# Altium schematic sheet BOOT_JTAG_AUX.SchDoc: =project_title
size Tabloid; CompanyName: Luxonis Holding; Organization: Luxonis Holding; Address1: 1925 Harmony Park Drive; Address2: Westminster, CO; Address3: 80234; Address4: United States; SheetNumber: 3; SheetTotal: 13
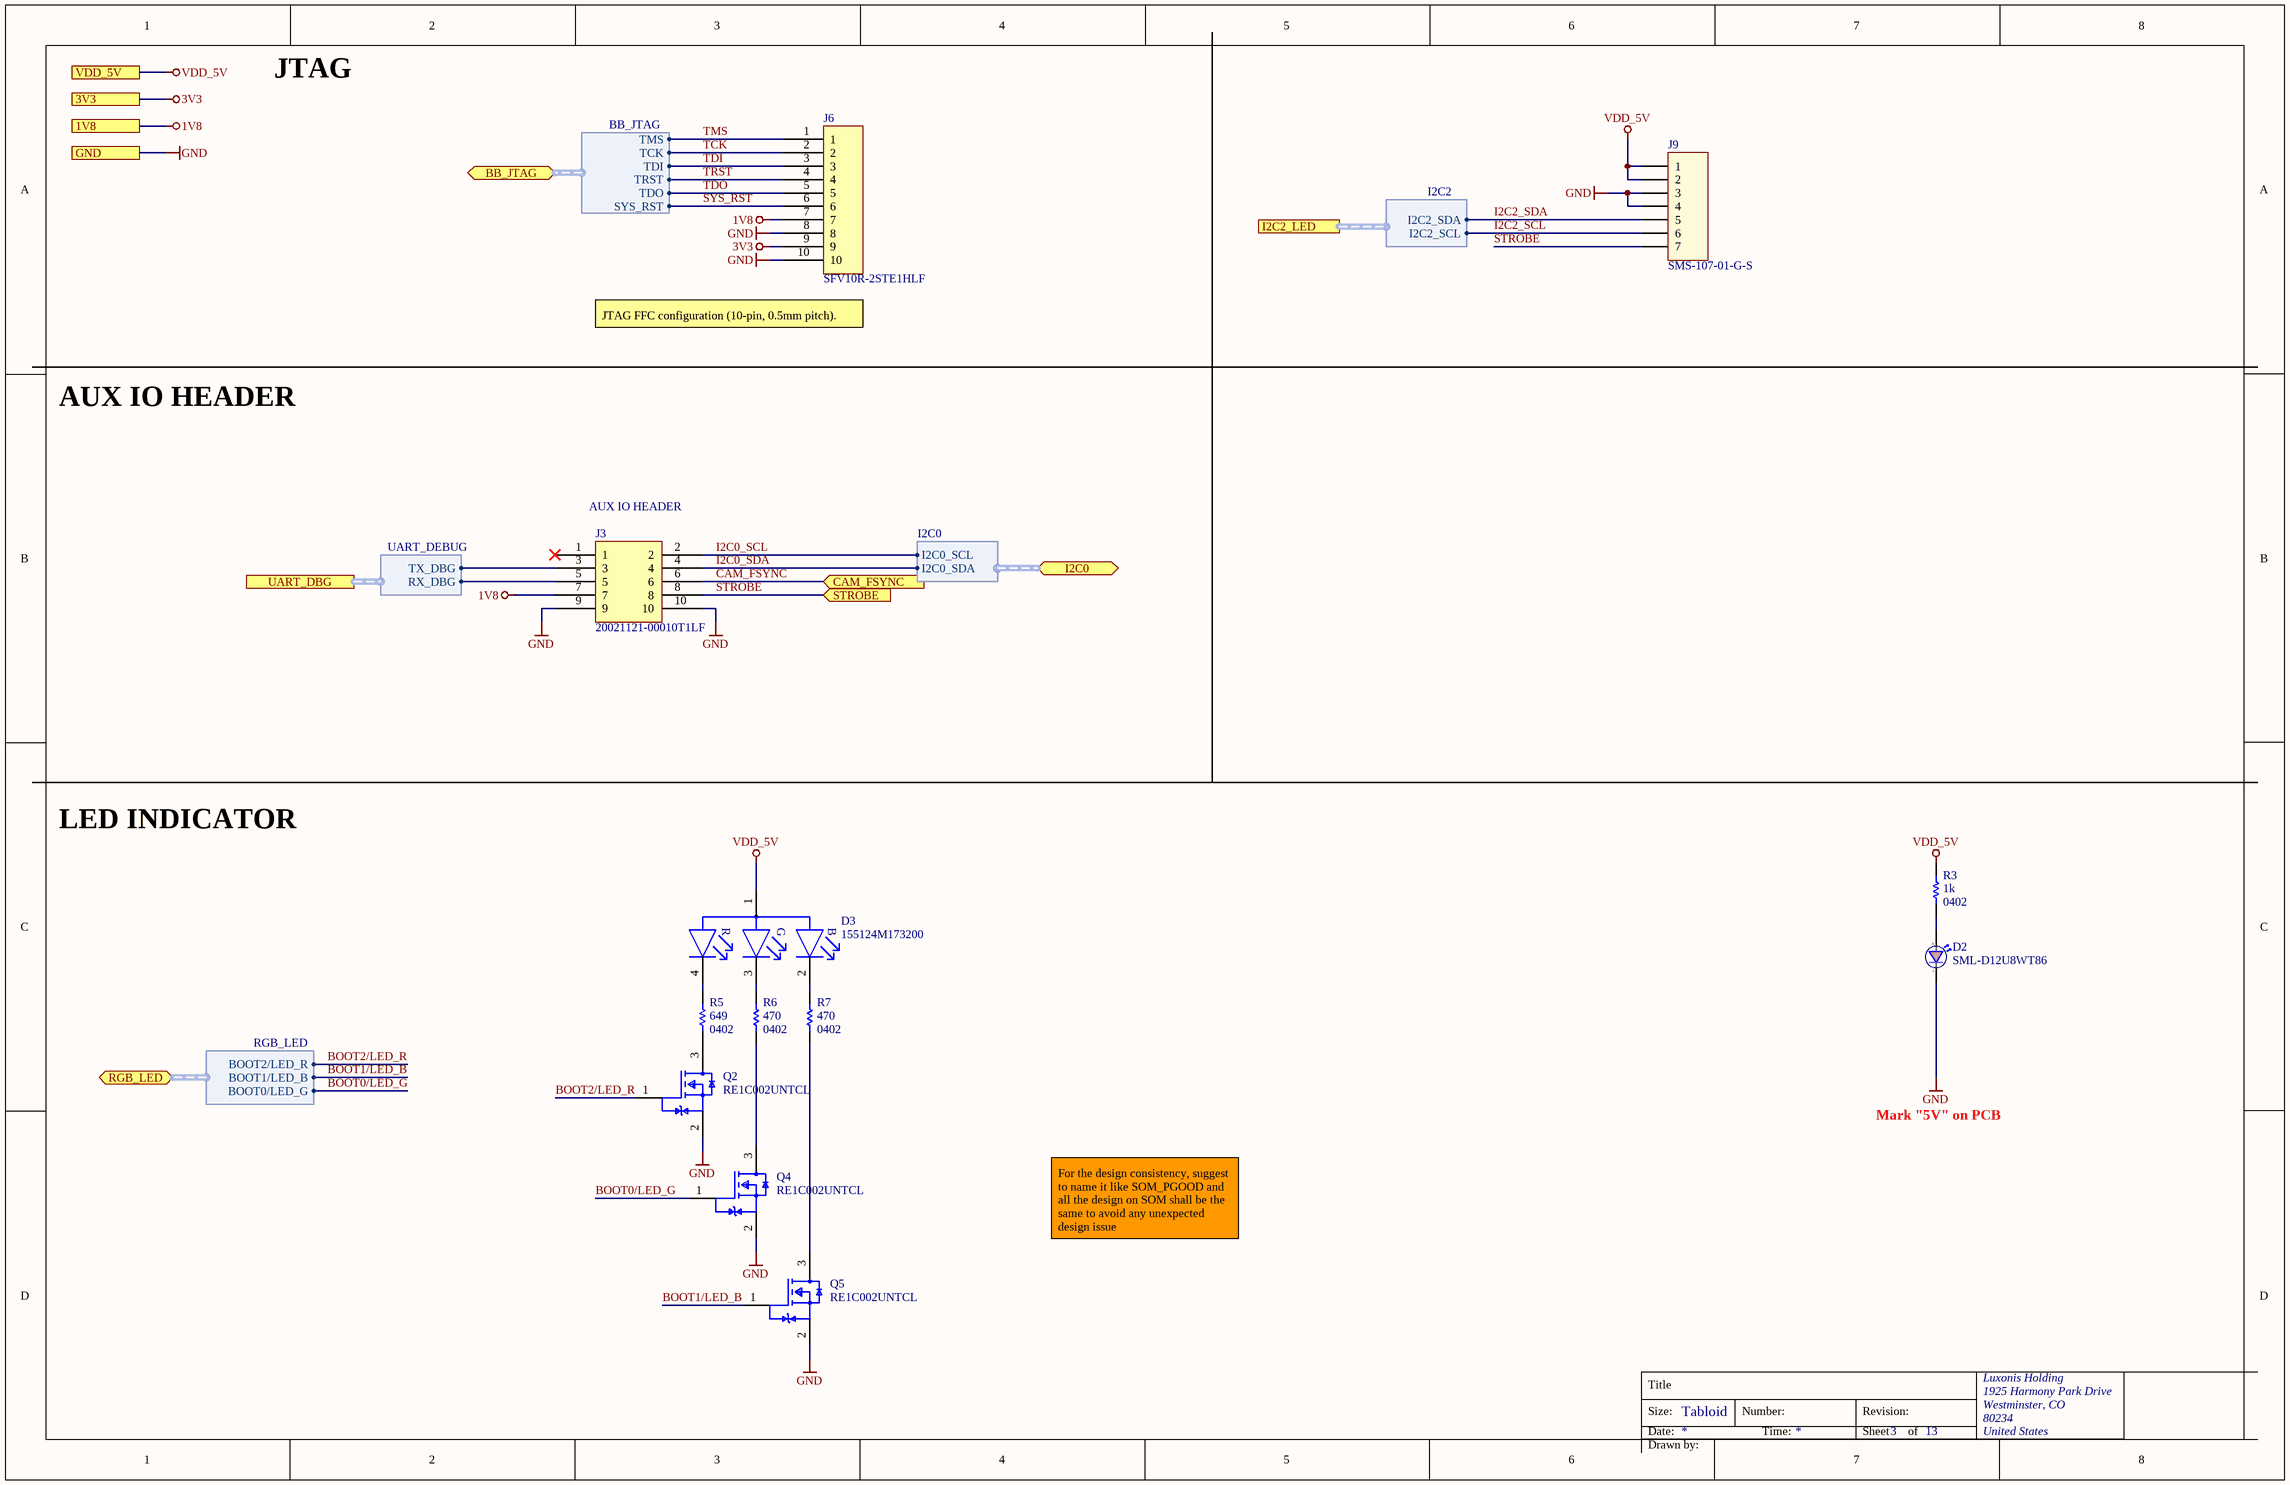
[diagram p0: BOOT_JTAG_AUX.SchDoc]

## Parts
D2  SML-D12U8WT86  [SML_D1xx8W]
D3  155124M173200  [FP-155124M173200-MFG]
J3  20021121-00010T1LF  [20021121-00010T1LF]
J6  SFV10R-2STE1HLF  [SFV10R-2STE1HLF]
J9  SMS-107-01-G-S  [SMS-107-01-G-S]
Q2  RE1C002UNTCL  [RE1C002UNTCL]
Q4  RE1C002UNTCL  [RE1C002UNTCL]
Q5  RE1C002UNTCL  [RE1C002UNTCL]
R3  value 1k  Case/Package: 0402  [RESC0402(1005)_L]  (hidden comment: RC0402FR-071KL)
R5  value 649  Case/Package: 0402  [RESC1005X40X25NL05T10]  (hidden comment: RC0402FR-07649RL)
R6  value 470  Case/Package: 0402  [RESC0402(1005)_L]  (hidden comment: CRCW0402470RFKED)
R7  value 470  Case/Package: 0402  [RESC0402(1005)_L]  (hidden comment: CRCW0402470RFKED)

## Ports
1V8, 3V3, BB_JTAG (bidir, harness BB_JTAG), CAM_FSYNC (in), GND, I2C0 (bidir, harness I2C0), I2C2_LED (harness I2C2), RGB_LED (bidir, harness RGB_LED), STROBE (in), UART_DBG (harness UART_DEBUG), VDD_5V

## Harnesses
BB_JTAG: TMS, TCK, TDI, TRST, TDO, SYS_RST
I2C0: I2C0_SDA, I2C0_SCL
RGB_LED: BOOT2/LED_R, BOOT1/LED_B, BOOT0/LED_G
UART_DEBUG: RX_DBG, TX_DBG
I2C2: I2C2_SDA, I2C2_SCL

## Nets
1V8: J3.7 J6.7 ; port 1V8
3V3: J6.9 ; port 3V3
GND: D2.1(C) J3.9 J3.10 J6.8 J6.10 J9.3 J9.4 Q2.2(Source) Q4.2(Source) Q5.2(Source) ; port GND
VDD_5V: D3.1(COMMON_ANODE) J9.1 J9.2 R3.2 ; port VDD_5V
BOOT0/LED_G: Q4.1(Gate) ; port RGB_LED.BOOT0/LED_G
BOOT1/LED_B: Q5.1(Gate) ; port RGB_LED.BOOT1/LED_B
BOOT2/LED_R: Q2.1(Gate) ; port RGB_LED.BOOT2/LED_R
CAM_FSYNC: J3.6 ; port CAM_FSYNC
I2C0_SCL: J3.2 ; port I2C0.I2C0_SCL
I2C0_SDA: J3.4 ; port I2C0.I2C0_SDA
I2C2_SCL: J9.6 ; port I2C2_LED.I2C2_SCL
I2C2_SDA: J9.5 ; port I2C2_LED.I2C2_SDA
STROBE: J3.8 J9.7 ; port STROBE
SYS_RST: J6.6 ; port BB_JTAG.SYS_RST
TCK: J6.2 ; port BB_JTAG.TCK
TDI: J6.3 ; port BB_JTAG.TDI
TDO: J6.5 ; port BB_JTAG.TDO
TMS: J6.1 ; port BB_JTAG.TMS
TRST: J6.4 ; port BB_JTAG.TRST
NetD2_2: D2.2(A) R3.1
NetD3_2: D3.2(BLUE_C) R7.2
NetD3_3: D3.3(GREEN_C) R6.2
NetD3_4: D3.4(RED_C) R5.2
NetJ3_3: J3.3 ; port UART_DBG.TX_DBG
NetJ3_5: J3.5 ; port UART_DBG.RX_DBG
NetQ2_3: Q2.3(Drain) R5.1
NetQ4_3: Q4.3(Drain) R6.1
NetQ5_3: Q5.3(Drain) R7.1

Not connected (* = marked no-connect by the designer): J3 1*

## Notes on the sheet
- JTAG
- (near J6) JTAG FFC configuration (10-pin, 0.5mm pitch).
- AUX IO HEADER
- (near J3) AUX IO HEADER
- LED INDICATOR
- Mark "5V" on PCB
- For the design consistency, suggest to name it like SOM_PGOOD and all the design on SOM shall be the same to avoid any unexpected design issue
- Title
- Size:
- Date:
- Tabloid
- Number:
- Time:
- Revision:
- Sheet
- of
- Drawn by:
- (in symbol CMP-007-00038-4) R; G; B

## Library data of the parts
D2 = CMP-111-000005-2: LED RED DIFFUSED 0603 SMD Red 620nm LED Indication - Discrete 2.2V 0603 (1608 Metric); Manufacturer 1: Rohm; Forward Current: 20mA; Manufacturer Part Number 1: SML-D12U8WT86; Case/Package: 0603; Forward Voltage: 2.2V; Min Operating Temperature: -40°C; Color: Red; Max Operating Temperature: 85°C
D3 = CMP-007-00038-4: Triple Color LED; Manufacturer 1: Wurth Elektronik; Max Current Rating: 30mA; Viewing Angle: 120°; Colour: RGB; Forward Current: 20mA; Case/Package: 1204; Manufacturer Part Number 1: 155124M173200
J3 = CMP-005-000031-2: CONN HEADER SMD 10POS 1.27MM; Manufacturer 1: Amphenol FCI; Number of Contacts: 10; Contact Resistance: 30mR; Max Voltage Rating (AC): 125V; Connector Type: Male Pin; Row Spacing: 0.05inch; Manufacturer Part Number 1: 20021121-00010T1LF; Stock 1: 1465; Pricing 1: 1=0.77000, 10=0.71800, 100=0.55040, 500=0.47860, 1000=0.39485, 5000=0.34699, 10000=0.32306 (USD); RoHS: Yes; Mount: Surface Mount; Contact Plating: Gold; Color: Black; Contact Material: Copper Alloy; Housing Color: Black; Housing Material: Thermoplastic; Min Operating Temperature: -40°C; Max Operating Temperature: 85°C; Number of Rows: 2; Termination: Solder; Package Quantity: 93; Packaging: Rail/Tube; Number of Positions: 10; Orientation: Straight; Length: 6.35mm; Pitch: 1.27mm; Contact Mating Length: 0.12inch; Depth: 3.4mm; ComponentLink1URL: https://datasheet.ciiva.com/18659/20021121-18659066.pdf?src-supplier=Digi-Key; ComponentLink1Description: https://datasheet.ciiva.com/18659/20021121-18659066.pdf?src-supplier=Digi-Key; ComponentLink2URL: https://datasheet.ciiva.com/10033/20021121-10033582.pdf?src-supplier=Avnet; ComponentLink2Description: https://datasheet.ciiva.com/10033/20021121-10033582.pdf?src-supplier=Avnet; Design Item ID: 20021121-00010T1LF; Pins: 10; Source: LuxonisMaster.SchLib
J6 = CMP-005-000024-3: CONN FFC TOP 10POS 0.50MM R/A; Manufacturer 1: Amphenol FCI; Pitch: 0.5mm; Voltage Rating: 50V; Gender: Female; Orientation: Right Angle; Max Operating Temperature: 105°C; Min Operating Temperature: -55°C; Mount: Surface Mount; Manufacturer Part Number 1: SFV10R-2STE1HLF; Pins: 10
J9 = CMP-00063-2: Board Connector, 7 Contact(s), 1 Row(s), Female, Straight, 0.05 inch Pitch, Solder Terminal, Black Insulator, Socket; Manufacturer Series: SMS; DIN Conformance: No; Body Length: 0.35inch; Mating Information: MULTIPLE MATING PARTS AVAILABLE; Number Of Connectors: 1; Rated Current (Signal): 1A; Additional Feature: TIGER BUY CONTACT; Reliability: COMMERCIAL; Option: General Purpose; Contact Style: SQ PIN-SKT; Contact Resistance: 10mR; Body Depth: 0.18inch; Insertion Force-Max: 2.224N; Reference Standard: UL; Plating Thickness: 30uin; Contact Pattern: RECTANGULAR; Number of Contacts: 7; Body Breadth: 0.1inch; Withdrawl Force-Min: 1.668N; Contact Gender: Female; Mixed Contacts: No; Manufacturer Part Number 1: SMS-107-01-G-S; Pins: 7; MIL Conformance: No; IEC Conformance: No; System: connector; Contact Finish - Termination: Tin (Sn) - with Nickel (Ni) barrier; Number of Rows Loaded: 1; JESD-609 Code: e3; Body/Shell Style: SOCKET; Terminal Length: 0.115inch; Mounting Technology: Board; Min Operating Temperature: -65°C; RoHS Compliant: Yes; Insulation Color: Black; Termination: Solder; Terminal Pitch: 1.27mm; Insulation Material: Glass; Max Operating Temperature: 125°C; Mating Contact Pitch: 0.05inch; Reach SVHC Compliant: Yes; Connector Type: BOARD CONNECTOR; Number Of PCB Rows: 1; PCB Contact Pattern: RECTANGULAR; Contact Finish - Mating: GOLD (30) OVER NICKEL (50); Contact Material: Bronze; Mounting Style: STRAIGHT; Filter Feature: No
Q2 Q4 Q5 = CMP-120-000001-2: MOSFET N-CH 20V 0.2A EMT3; Manufacturer 1: Rohm; Continuous Drain Current: 200mA; Case/Package: SOT-89; Manufacturer Part Number 1: RE1C002UNTCL; Design Item ID: RE1C002UNTCL; Max Drain to Source Voltage: 20V
R3 = CMP-013-000004-10: RES SMD 1K OHM 1% 1/16W 0402; Manufacturer 1: Yageo; Power Rating: 62.5mW; Voltage Rating: 50V; Min Operating Temperature: -55°C; Design Item ID: RC0402FR-071KL; Tolerance: 1%; Max Operating Temperature: 155°C; Manufacturer Part Number 1: RC0402FR-071KL
R5 = CMP-009-00231-10: RES SMD 649 OHM 1% 1/16W 0402; Manufacturer 1: YAGEO; Voltage Rating: 50V; Manufacturer Part Number 1: RC0402FR-07649RL; Tolerance: 1%
R6 = CMP-013-000029-9: RES SMD 470 OHM 1% 1/16W 0402; Manufacturer 1: Vishay; Voltage Rating: 50V; Power Rating: 63mW; Max Operating Temperature: 155°C; Min Operating Temperature: -55°C; Manufacturer Part Number 1: CRCW0402470RFKED; Tolerance: 1%; Design Item ID: CRCW0402470RFKED
R7 = CMP-013-000029-9: RES SMD 470 OHM 1% 1/16W 0402; Manufacturer 1: Vishay; Power Rating: 63mW; Voltage Rating: 50V; Min Operating Temperature: -55°C; Max Operating Temperature: 155°C; Tolerance: 1%; Manufacturer Part Number 1: CRCW0402470RFKED; Design Item ID: CRCW0402470RFKED